# Altium project keyboard_full.PrjPcb
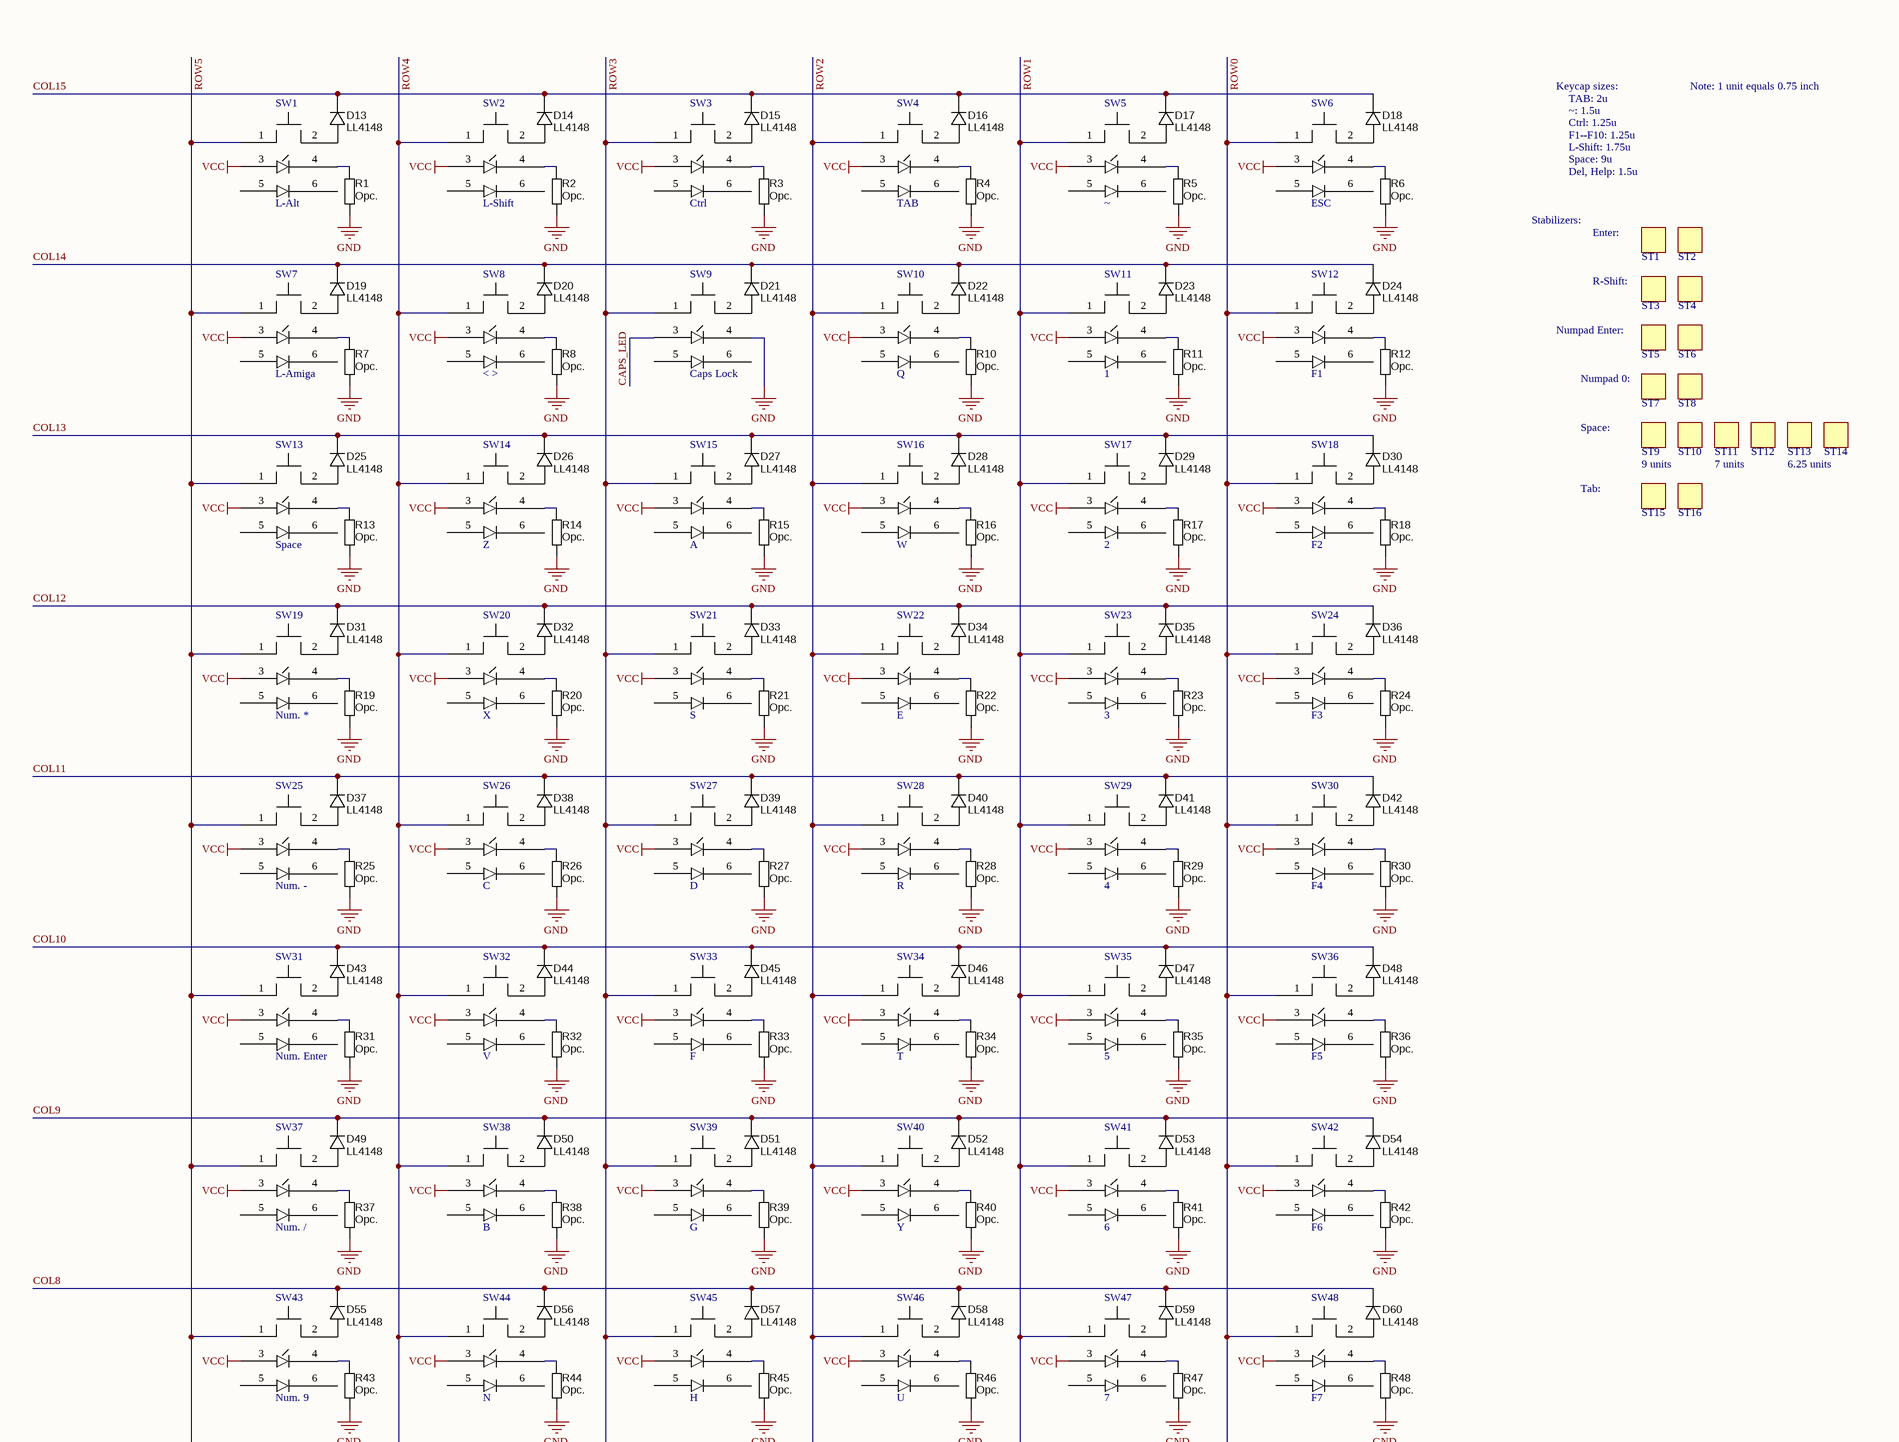
[diagram p0: keyboard_matrix_full.SchDoc, top]
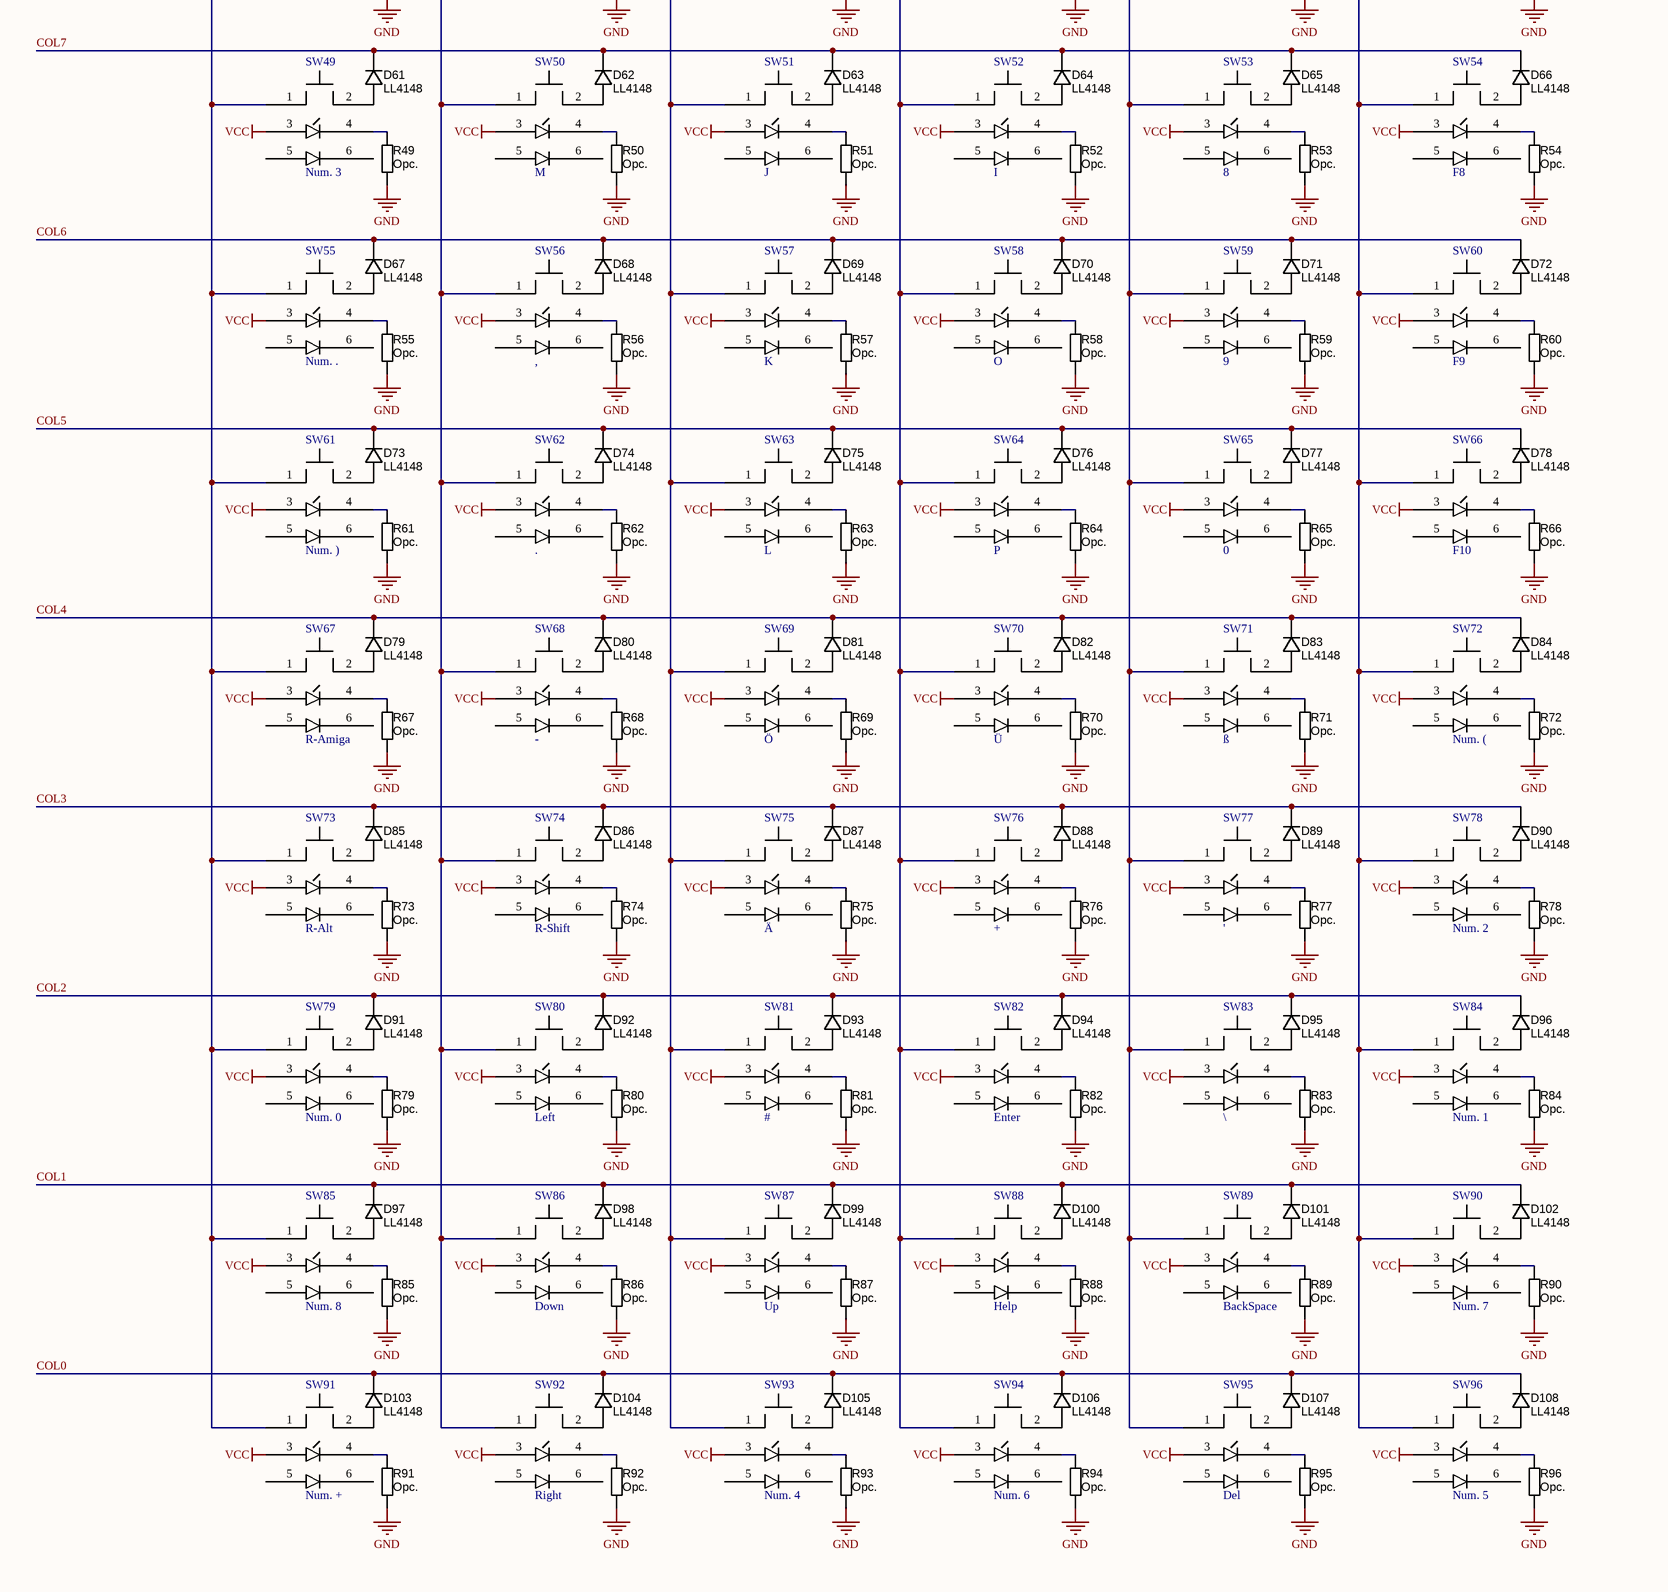
[diagram p1: keyboard_matrix_full.SchDoc, bottom]
2 sheets, 342 parts. Net scope: global (net labels, ports and power ports of the same name join across sheets).
Board file: keyboard_full.PcbDoc
Sheets:
  keyboard_matrix_full.SchDoc
  keyboard_controller.SchDoc

## Sheet keyboard_matrix_full.SchDoc
size 419 x 594 mm

### Parts
D13  Manufacturer Part Number 1: LL4148  [SOD80, LL-34]  (hidden comment: Mini MELF)
D14  Manufacturer Part Number 1: LL4148  [SOD80, LL-34]  (hidden comment: Mini MELF)
D15  Manufacturer Part Number 1: LL4148  [SOD80, LL-34]  (hidden comment: Mini MELF)
D16  Manufacturer Part Number 1: LL4148  [SOD80, LL-34]  (hidden comment: Mini MELF)
D17  Manufacturer Part Number 1: LL4148  [SOD80, LL-34]  (hidden comment: Mini MELF)
D18  Manufacturer Part Number 1: LL4148  [SOD80, LL-34]  (hidden comment: Mini MELF)
D19  Manufacturer Part Number 1: LL4148  [SOD80, LL-34]  (hidden comment: Mini MELF)
D20  Manufacturer Part Number 1: LL4148  [SOD80, LL-34]  (hidden comment: Mini MELF)
D21  Manufacturer Part Number 1: LL4148  [SOD80, LL-34]  (hidden comment: Mini MELF)
D22  Manufacturer Part Number 1: LL4148  [SOD80, LL-34]  (hidden comment: Mini MELF)
D23  Manufacturer Part Number 1: LL4148  [SOD80, LL-34]  (hidden comment: Mini MELF)
D24  Manufacturer Part Number 1: LL4148  [SOD80, LL-34]  (hidden comment: Mini MELF)
D25  Manufacturer Part Number 1: LL4148  [SOD80, LL-34]  (hidden comment: Mini MELF)
D26  Manufacturer Part Number 1: LL4148  [SOD80, LL-34]  (hidden comment: Mini MELF)
D27  Manufacturer Part Number 1: LL4148  [SOD80, LL-34]  (hidden comment: Mini MELF)
D28  Manufacturer Part Number 1: LL4148  [SOD80, LL-34]  (hidden comment: Mini MELF)
D29  Manufacturer Part Number 1: LL4148  [SOD80, LL-34]  (hidden comment: Mini MELF)
D30  Manufacturer Part Number 1: LL4148  [SOD80, LL-34]  (hidden comment: Mini MELF)
D31  Manufacturer Part Number 1: LL4148  [SOD80, LL-34]  (hidden comment: Mini MELF)
D32  Manufacturer Part Number 1: LL4148  [SOD80, LL-34]  (hidden comment: Mini MELF)
D33  Manufacturer Part Number 1: LL4148  [SOD80, LL-34]  (hidden comment: Mini MELF)
D34  Manufacturer Part Number 1: LL4148  [SOD80, LL-34]  (hidden comment: Mini MELF)
D35  Manufacturer Part Number 1: LL4148  [SOD80, LL-34]  (hidden comment: Mini MELF)
D36  Manufacturer Part Number 1: LL4148  [SOD80, LL-34]  (hidden comment: Mini MELF)
D37  Manufacturer Part Number 1: LL4148  [SOD80, LL-34]  (hidden comment: Mini MELF)
D38  Manufacturer Part Number 1: LL4148  [SOD80, LL-34]  (hidden comment: Mini MELF)
D39  Manufacturer Part Number 1: LL4148  [SOD80, LL-34]  (hidden comment: Mini MELF)
D40  Manufacturer Part Number 1: LL4148  [SOD80, LL-34]  (hidden comment: Mini MELF)
D41  Manufacturer Part Number 1: LL4148  [SOD80, LL-34]  (hidden comment: Mini MELF)
D42  Manufacturer Part Number 1: LL4148  [SOD80, LL-34]  (hidden comment: Mini MELF)
D43  Manufacturer Part Number 1: LL4148  [SOD80, LL-34]  (hidden comment: Mini MELF)
D44  Manufacturer Part Number 1: LL4148  [SOD80, LL-34]  (hidden comment: Mini MELF)
D45  Manufacturer Part Number 1: LL4148  [SOD80, LL-34]  (hidden comment: Mini MELF)
D46  Manufacturer Part Number 1: LL4148  [SOD80, LL-34]  (hidden comment: Mini MELF)
D47  Manufacturer Part Number 1: LL4148  [SOD80, LL-34]  (hidden comment: Mini MELF)
D48  Manufacturer Part Number 1: LL4148  [SOD80, LL-34]  (hidden comment: Mini MELF)
D49  Manufacturer Part Number 1: LL4148  [SOD80, LL-34]  (hidden comment: Mini MELF)
D50  Manufacturer Part Number 1: LL4148  [SOD80, LL-34]  (hidden comment: Mini MELF)
D51  Manufacturer Part Number 1: LL4148  [SOD80, LL-34]  (hidden comment: Mini MELF)
D52  Manufacturer Part Number 1: LL4148  [SOD80, LL-34]  (hidden comment: Mini MELF)
D53  Manufacturer Part Number 1: LL4148  [SOD80, LL-34]  (hidden comment: Mini MELF)
D54  Manufacturer Part Number 1: LL4148  [SOD80, LL-34]  (hidden comment: Mini MELF)
D55  Manufacturer Part Number 1: LL4148  [SOD80, LL-34]  (hidden comment: Mini MELF)
D56  Manufacturer Part Number 1: LL4148  [SOD80, LL-34]  (hidden comment: Mini MELF)
D57  Manufacturer Part Number 1: LL4148  [SOD80, LL-34]  (hidden comment: Mini MELF)
D58  Manufacturer Part Number 1: LL4148  [SOD80, LL-34]  (hidden comment: Mini MELF)
D59  Manufacturer Part Number 1: LL4148  [SOD80, LL-34]  (hidden comment: Mini MELF)
D60  Manufacturer Part Number 1: LL4148  [SOD80, LL-34]  (hidden comment: Mini MELF)
D61  Manufacturer Part Number 1: LL4148  [SOD80, LL-34]  (hidden comment: Mini MELF)
D62  Manufacturer Part Number 1: LL4148  [SOD80, LL-34]  (hidden comment: Mini MELF)
D63  Manufacturer Part Number 1: LL4148  [SOD80, LL-34]  (hidden comment: Mini MELF)
D64  Manufacturer Part Number 1: LL4148  [SOD80, LL-34]  (hidden comment: Mini MELF)
D65  Manufacturer Part Number 1: LL4148  [SOD80, LL-34]  (hidden comment: Mini MELF)
D66  Manufacturer Part Number 1: LL4148  [SOD80, LL-34]  (hidden comment: Mini MELF)
D67  Manufacturer Part Number 1: LL4148  [SOD80, LL-34]  (hidden comment: Mini MELF)
D68  Manufacturer Part Number 1: LL4148  [SOD80, LL-34]  (hidden comment: Mini MELF)
D69  Manufacturer Part Number 1: LL4148  [SOD80, LL-34]  (hidden comment: Mini MELF)
D70  Manufacturer Part Number 1: LL4148  [SOD80, LL-34]  (hidden comment: Mini MELF)
D71  Manufacturer Part Number 1: LL4148  [SOD80, LL-34]  (hidden comment: Mini MELF)
D72  Manufacturer Part Number 1: LL4148  [SOD80, LL-34]  (hidden comment: Mini MELF)
D73  Manufacturer Part Number 1: LL4148  [SOD80, LL-34]  (hidden comment: Mini MELF)
D74  Manufacturer Part Number 1: LL4148  [SOD80, LL-34]  (hidden comment: Mini MELF)
D75  Manufacturer Part Number 1: LL4148  [SOD80, LL-34]  (hidden comment: Mini MELF)
D76  Manufacturer Part Number 1: LL4148  [SOD80, LL-34]  (hidden comment: Mini MELF)
D77  Manufacturer Part Number 1: LL4148  [SOD80, LL-34]  (hidden comment: Mini MELF)
D78  Manufacturer Part Number 1: LL4148  [SOD80, LL-34]  (hidden comment: Mini MELF)
D79  Manufacturer Part Number 1: LL4148  [SOD80, LL-34]  (hidden comment: Mini MELF)
D80  Manufacturer Part Number 1: LL4148  [SOD80, LL-34]  (hidden comment: Mini MELF)
D81  Manufacturer Part Number 1: LL4148  [SOD80, LL-34]  (hidden comment: Mini MELF)
D82  Manufacturer Part Number 1: LL4148  [SOD80, LL-34]  (hidden comment: Mini MELF)
D83  Manufacturer Part Number 1: LL4148  [SOD80, LL-34]  (hidden comment: Mini MELF)
D84  Manufacturer Part Number 1: LL4148  [SOD80, LL-34]  (hidden comment: Mini MELF)
D85  Manufacturer Part Number 1: LL4148  [SOD80, LL-34]  (hidden comment: Mini MELF)
D86  Manufacturer Part Number 1: LL4148  [SOD80, LL-34]  (hidden comment: Mini MELF)
D87  Manufacturer Part Number 1: LL4148  [SOD80, LL-34]  (hidden comment: Mini MELF)
D88  Manufacturer Part Number 1: LL4148  [SOD80, LL-34]  (hidden comment: Mini MELF)
D89  Manufacturer Part Number 1: LL4148  [SOD80, LL-34]  (hidden comment: Mini MELF)
D90  Manufacturer Part Number 1: LL4148  [SOD80, LL-34]  (hidden comment: Mini MELF)
D91  Manufacturer Part Number 1: LL4148  [SOD80, LL-34]  (hidden comment: Mini MELF)
D92  Manufacturer Part Number 1: LL4148  [SOD80, LL-34]  (hidden comment: Mini MELF)
D93  Manufacturer Part Number 1: LL4148  [SOD80, LL-34]  (hidden comment: Mini MELF)
D94  Manufacturer Part Number 1: LL4148  [SOD80, LL-34]  (hidden comment: Mini MELF)
D95  Manufacturer Part Number 1: LL4148  [SOD80, LL-34]  (hidden comment: Mini MELF)
D96  Manufacturer Part Number 1: LL4148  [SOD80, LL-34]  (hidden comment: Mini MELF)
D97  Manufacturer Part Number 1: LL4148  [SOD80, LL-34]  (hidden comment: Mini MELF)
D98  Manufacturer Part Number 1: LL4148  [SOD80, LL-34]  (hidden comment: Mini MELF)
D99  Manufacturer Part Number 1: LL4148  [SOD80, LL-34]  (hidden comment: Mini MELF)
D100  Manufacturer Part Number 1: LL4148  [SOD80, LL-34]  (hidden comment: Mini MELF)
D101  Manufacturer Part Number 1: LL4148  [SOD80, LL-34]  (hidden comment: Mini MELF)
D102  Manufacturer Part Number 1: LL4148  [SOD80, LL-34]  (hidden comment: Mini MELF)
D103  Manufacturer Part Number 1: LL4148  [SOD80, LL-34]  (hidden comment: Mini MELF)
D104  Manufacturer Part Number 1: LL4148  [SOD80, LL-34]  (hidden comment: Mini MELF)
D105  Manufacturer Part Number 1: LL4148  [SOD80, LL-34]  (hidden comment: Mini MELF)
D106  Manufacturer Part Number 1: LL4148  [SOD80, LL-34]  (hidden comment: Mini MELF)
D107  Manufacturer Part Number 1: LL4148  [SOD80, LL-34]  (hidden comment: Mini MELF)
D108  Manufacturer Part Number 1: LL4148  [SOD80, LL-34]  (hidden comment: Mini MELF)
R1  value Opc.  [RESC2012N_ZERO]  (hidden comment: 0805)
R2  value Opc.  [RESC2012N_ZERO]  (hidden comment: 0805)
R3  value Opc.  [RESC2012N_ZERO]  (hidden comment: 0805)
R4  value Opc.  [RESC2012N_ZERO]  (hidden comment: 0805)
R5  value Opc.  [RESC2012N_ZERO]  (hidden comment: 0805)
R6  value Opc.  [RESC2012N_ZERO]  (hidden comment: 0805)
R7  value Opc.  [RESC2012N_ZERO]  (hidden comment: 0805)
R8  value Opc.  [RESC2012N_ZERO]  (hidden comment: 0805)
R10  value Opc.  [RESC2012N_ZERO]  (hidden comment: 0805)
R11  value Opc.  [RESC2012N_ZERO]  (hidden comment: 0805)
R12  value Opc.  [RESC2012N_ZERO]  (hidden comment: 0805)
R13  value Opc.  [RESC2012N_ZERO]  (hidden comment: 0805)
R14  value Opc.  [RESC2012N_ZERO]  (hidden comment: 0805)
R15  value Opc.  [RESC2012N_ZERO]  (hidden comment: 0805)
R16  value Opc.  [RESC2012N_ZERO]  (hidden comment: 0805)
R17  value Opc.  [RESC2012N_ZERO]  (hidden comment: 0805)
R18  value Opc.  [RESC2012N_ZERO]  (hidden comment: 0805)
R19  value Opc.  [RESC2012N_ZERO]  (hidden comment: 0805)
R20  value Opc.  [RESC2012N_ZERO]  (hidden comment: 0805)
R21  value Opc.  [RESC2012N_ZERO]  (hidden comment: 0805)
R22  value Opc.  [RESC2012N_ZERO]  (hidden comment: 0805)
R23  value Opc.  [RESC2012N_ZERO]  (hidden comment: 0805)
R24  value Opc.  [RESC2012N_ZERO]  (hidden comment: 0805)
R25  value Opc.  [RESC2012N_ZERO]  (hidden comment: 0805)
R26  value Opc.  [RESC2012N_ZERO]  (hidden comment: 0805)
R27  value Opc.  [RESC2012N_ZERO]  (hidden comment: 0805)
R28  value Opc.  [RESC2012N_ZERO]  (hidden comment: 0805)
R29  value Opc.  [RESC2012N_ZERO]  (hidden comment: 0805)
R30  value Opc.  [RESC2012N_ZERO]  (hidden comment: 0805)
R31  value Opc.  [RESC2012N_ZERO]  (hidden comment: 0805)
R32  value Opc.  [RESC2012N_ZERO]  (hidden comment: 0805)
R33  value Opc.  [RESC2012N_ZERO]  (hidden comment: 0805)
R34  value Opc.  [RESC2012N_ZERO]  (hidden comment: 0805)
R35  value Opc.  [RESC2012N_ZERO]  (hidden comment: 0805)
R36  value Opc.  [RESC2012N_ZERO]  (hidden comment: 0805)
R37  value Opc.  [RESC2012N_ZERO]  (hidden comment: 0805)
R38  value Opc.  [RESC2012N_ZERO]  (hidden comment: 0805)
R39  value Opc.  [RESC2012N_ZERO]  (hidden comment: 0805)
R40  value Opc.  [RESC2012N_ZERO]  (hidden comment: 0805)
R41  value Opc.  [RESC2012N_ZERO]  (hidden comment: 0805)
R42  value Opc.  [RESC2012N_ZERO]  (hidden comment: 0805)
R43  value Opc.  [RESC2012N_ZERO]  (hidden comment: 0805)
R44  value Opc.  [RESC2012N_ZERO]  (hidden comment: 0805)
R45  value Opc.  [RESC2012N_ZERO]  (hidden comment: 0805)
R46  value Opc.  [RESC2012N_ZERO]  (hidden comment: 0805)
R47  value Opc.  [RESC2012N_ZERO]  (hidden comment: 0805)
R48  value Opc.  [RESC2012N_ZERO]  (hidden comment: 0805)
R49  value Opc.  [RESC2012N_ZERO]  (hidden comment: 0805)
R50  value Opc.  [RESC2012N_ZERO]  (hidden comment: 0805)
R51  value Opc.  [RESC2012N_ZERO]  (hidden comment: 0805)
R52  value Opc.  [RESC2012N_ZERO]  (hidden comment: 0805)
R53  value Opc.  [RESC2012N_ZERO]  (hidden comment: 0805)
R54  value Opc.  [RESC2012N_ZERO]  (hidden comment: 0805)
R55  value Opc.  [RESC2012N_ZERO]  (hidden comment: 0805)
R56  value Opc.  [RESC2012N_ZERO]  (hidden comment: 0805)
R57  value Opc.  [RESC2012N_ZERO]  (hidden comment: 0805)
R58  value Opc.  [RESC2012N_ZERO]  (hidden comment: 0805)
R59  value Opc.  [RESC2012N_ZERO]  (hidden comment: 0805)
R60  value Opc.  [RESC2012N_ZERO]  (hidden comment: 0805)
R61  value Opc.  [RESC2012N_ZERO]  (hidden comment: 0805)
R62  value Opc.  [RESC2012N_ZERO]  (hidden comment: 0805)
R63  value Opc.  [RESC2012N_ZERO]  (hidden comment: 0805)
R64  value Opc.  [RESC2012N_ZERO]  (hidden comment: 0805)
R65  value Opc.  [RESC2012N_ZERO]  (hidden comment: 0805)
R66  value Opc.  [RESC2012N_ZERO]  (hidden comment: 0805)
R67  value Opc.  [RESC2012N_ZERO]  (hidden comment: 0805)
R68  value Opc.  [RESC2012N_ZERO]  (hidden comment: 0805)
R69  value Opc.  [RESC2012N_ZERO]  (hidden comment: 0805)
R70  value Opc.  [RESC2012N_ZERO]  (hidden comment: 0805)
R71  value Opc.  [RESC2012N_ZERO]  (hidden comment: 0805)
R72  value Opc.  [RESC2012N_ZERO]  (hidden comment: 0805)
R73  value Opc.  [RESC2012N_ZERO]  (hidden comment: 0805)
R74  value Opc.  [RESC2012N_ZERO]  (hidden comment: 0805)
R75  value Opc.  [RESC2012N_ZERO]  (hidden comment: 0805)
R76  value Opc.  [RESC2012N_ZERO]  (hidden comment: 0805)
R77  value Opc.  [RESC2012N_ZERO]  (hidden comment: 0805)
R78  value Opc.  [RESC2012N_ZERO]  (hidden comment: 0805)
R79  value Opc.  [RESC2012N_ZERO]  (hidden comment: 0805)
R80  value Opc.  [RESC2012N_ZERO]  (hidden comment: 0805)
R81  value Opc.  [RESC2012N_ZERO]  (hidden comment: 0805)
R82  value Opc.  [RESC2012N_ZERO]  (hidden comment: 0805)
R83  value Opc.  [RESC2012N_ZERO]  (hidden comment: 0805)
R84  value Opc.  [RESC2012N_ZERO]  (hidden comment: 0805)
R85  value Opc.  [RESC2012N_ZERO]  (hidden comment: 0805)
R86  value Opc.  [RESC2012N_ZERO]  (hidden comment: 0805)
R87  value Opc.  [RESC2012N_ZERO]  (hidden comment: 0805)
R88  value Opc.  [RESC2012N_ZERO]  (hidden comment: 0805)
R89  value Opc.  [RESC2012N_ZERO]  (hidden comment: 0805)
R90  value Opc.  [RESC2012N_ZERO]  (hidden comment: 0805)
R91  value Opc.  [RESC2012N_ZERO]  (hidden comment: 0805)
R92  value Opc.  [RESC2012N_ZERO]  (hidden comment: 0805)
R93  value Opc.  [RESC2012N_ZERO]  (hidden comment: 0805)
R94  value Opc.  [RESC2012N_ZERO]  (hidden comment: 0805)
R95  value Opc.  [RESC2012N_ZERO]  (hidden comment: 0805)
R96  value Opc.  [RESC2012N_ZERO]  (hidden comment: 0805)
ST1  Cherry MX Stabilizer  [CHERRYMX_STAB]  (value not drawn)
ST2  Cherry MX Stabilizer  [CHERRYMX_STAB]  (value not drawn)
ST3  Cherry MX Stabilizer  [CHERRYMX_STAB]  (value not drawn)
ST4  Cherry MX Stabilizer  [CHERRYMX_STAB]  (value not drawn)
ST5  Cherry MX Stabilizer  [CHERRYMX_STAB]  (value not drawn)
ST6  Cherry MX Stabilizer  [CHERRYMX_STAB]  (value not drawn)
ST7  Cherry MX Stabilizer  [CHERRYMX_STAB]  (value not drawn)
ST8  Cherry MX Stabilizer  [CHERRYMX_STAB]  (value not drawn)
ST9  Cherry MX Stabilizer  [CHERRYMX_STAB]  (value not drawn)
ST10  Cherry MX Stabilizer  [CHERRYMX_STAB]  (value not drawn)
ST11  Cherry MX Stabilizer  [CHERRYMX_STAB]  (value not drawn)
ST12  Cherry MX Stabilizer  [CHERRYMX_STAB]  (value not drawn)
ST13  Cherry MX Stabilizer  [CHERRYMX_STAB]  (value not drawn)
ST14  Cherry MX Stabilizer  [CHERRYMX_STAB]  (value not drawn)
ST15  Cherry MX Stabilizer  [CHERRYMX_STAB]  (value not drawn)
ST16  Cherry MX Stabilizer  [CHERRYMX_STAB]  (value not drawn)
SW1  L-Alt  [CHERRYMX_5PIN]
SW2  L-Shift  [CHERRYMX_5PIN]
SW3  Ctrl  [CHERRYMX_5PIN]
SW4  TAB  [CHERRYMX_5PIN]
SW5  ~  [CHERRYMX_5PIN]
SW6  ESC  [CHERRYMX_5PIN]
SW7  L-Amiga  [CHERRYMX_5PIN]
SW8  < >  [CHERRYMX_5PIN]
SW9  Caps Lock  [CHERRYMX_5PIN]
SW10  Q  [CHERRYMX_5PIN]
SW11  1  [CHERRYMX_5PIN]
SW12  F1  [CHERRYMX_5PIN]
SW13  Space  [CHERRYMX_5PIN]
SW14  Z  [CHERRYMX_5PIN]
SW15  A  [CHERRYMX_5PIN]
SW16  W  [CHERRYMX_5PIN]
SW17  2  [CHERRYMX_5PIN]
SW18  F2  [CHERRYMX_5PIN]
SW19  Num. *  [CHERRYMX_5PIN]
SW20  X  [CHERRYMX_5PIN]
SW21  S  [CHERRYMX_5PIN]
SW22  E  [CHERRYMX_5PIN]
SW23  3  [CHERRYMX_5PIN]
SW24  F3  [CHERRYMX_5PIN]
SW25  Num. -  [CHERRYMX_5PIN]
SW26  C  [CHERRYMX_5PIN]
SW27  D  [CHERRYMX_5PIN]
SW28  R  [CHERRYMX_5PIN]
SW29  4  [CHERRYMX_5PIN]
SW30  F4  [CHERRYMX_5PIN]
SW31  Num. Enter  [CHERRYMX_5PIN]
SW32  V  [CHERRYMX_5PIN]
SW33  F  [CHERRYMX_5PIN]
SW34  T  [CHERRYMX_5PIN]
SW35  5  [CHERRYMX_5PIN]
SW36  F5  [CHERRYMX_5PIN]
SW37  Num. /  [CHERRYMX_5PIN]
SW38  B  [CHERRYMX_5PIN]
SW39  G  [CHERRYMX_5PIN]
SW40  Y  [CHERRYMX_5PIN]
SW41  6  [CHERRYMX_5PIN]
SW42  F6  [CHERRYMX_5PIN]
SW43  Num. 9  [CHERRYMX_5PIN]
SW44  N  [CHERRYMX_5PIN]
SW45  H  [CHERRYMX_5PIN]
SW46  U  [CHERRYMX_5PIN]
SW47  7  [CHERRYMX_5PIN]
SW48  F7  [CHERRYMX_5PIN]
SW49  Num. 3  [CHERRYMX_5PIN]
SW50  M  [CHERRYMX_5PIN]
SW51  J  [CHERRYMX_5PIN]
SW52  I  [CHERRYMX_5PIN]
SW53  8  [CHERRYMX_5PIN]
SW54  F8  [CHERRYMX_5PIN]
SW55  Num. .  [CHERRYMX_5PIN]
SW56  ,  [CHERRYMX_5PIN]
SW57  K  [CHERRYMX_5PIN]
SW58  O  [CHERRYMX_5PIN]
SW59  9  [CHERRYMX_5PIN]
SW60  F9  [CHERRYMX_5PIN]
SW61  Num. )  [CHERRYMX_5PIN]
SW62  .  [CHERRYMX_5PIN]
SW63  L  [CHERRYMX_5PIN]
SW64  P  [CHERRYMX_5PIN]
SW65  0  [CHERRYMX_5PIN]
SW66  F10  [CHERRYMX_5PIN]
SW67  R-Amiga  [CHERRYMX_5PIN]
SW68  -  [CHERRYMX_5PIN]
SW69  Ö  [CHERRYMX_5PIN]
SW70  Ü  [CHERRYMX_5PIN]
SW71  ß  [CHERRYMX_5PIN]
SW72  Num. (  [CHERRYMX_5PIN]
SW73  R-Alt  [CHERRYMX_5PIN]
SW74  R-Shift  [CHERRYMX_5PIN]
SW75  Ä  [CHERRYMX_5PIN]
SW76  +  [CHERRYMX_5PIN]
SW77  '  [CHERRYMX_5PIN]
SW78  Num. 2  [CHERRYMX_5PIN]
SW79  Num. 0  [CHERRYMX_5PIN]
SW80  Left  [CHERRYMX_5PIN]
SW81  #  [CHERRYMX_5PIN]
SW82  Enter  [CHERRYMX_5PIN]
SW83  \  [CHERRYMX_5PIN]
SW84  Num. 1  [CHERRYMX_5PIN]
SW85  Num. 8  [CHERRYMX_5PIN]
SW86  Down  [CHERRYMX_5PIN]
SW87  Up  [CHERRYMX_5PIN]
SW88  Help  [CHERRYMX_5PIN]
SW89  BackSpace  [CHERRYMX_5PIN]
SW90  Num. 7  [CHERRYMX_5PIN]
SW91  Num. +  [CHERRYMX_5PIN]
SW92  Right  [CHERRYMX_5PIN]
SW93  Num. 4  [CHERRYMX_5PIN]
SW94  Num. 6  [CHERRYMX_5PIN]
SW95  Del  [CHERRYMX_5PIN]
SW96  Num. 5  [CHERRYMX_5PIN]

### Nets
GND: R1.2 R2.2 R3.2 R4.2 R5.2 R6.2 R7.2 R8.2 R10.2 R11.2 R12.2 R13.2 R14.2 R15.2 R16.2 R17.2 R18.2 R19.2 R20.2 R21.2 R22.2 R23.2 R24.2 R25.2 R26.2 R27.2 R28.2 R29.2 R30.2 R31.2 R32.2 R33.2 R34.2 R35.2 R36.2 R37.2 R38.2 R39.2 R40.2 R41.2 R42.2 R43.2 R44.2 R45.2 R46.2 R47.2 R48.2 R49.2 R50.2 R51.2 R52.2 R53.2 R54.2 R55.2 R56.2 R57.2 R58.2 R59.2 R60.2 R61.2 R62.2 R63.2 R64.2 R65.2 R66.2 R67.2 R68.2 R69.2 R70.2 R71.2 R72.2 R73.2 R74.2 R75.2 R76.2 R77.2 R78.2 R79.2 R80.2 R81.2 R82.2 R83.2 R84.2 R85.2 R86.2 R87.2 R88.2 R89.2 R90.2 R91.2 R92.2 R93.2 R94.2 R95.2 R96.2 SW9.4
VCC: SW1.3 SW2.3 SW3.3 SW4.3 SW5.3 SW6.3 SW7.3 SW8.3 SW10.3 SW11.3 SW12.3 SW13.3 SW14.3 SW15.3 SW16.3 SW17.3 SW18.3 SW19.3 SW20.3 SW21.3 SW22.3 SW23.3 SW24.3 SW25.3 SW26.3 SW27.3 SW28.3 SW29.3 SW30.3 SW31.3 SW32.3 SW33.3 SW34.3 SW35.3 SW36.3 SW37.3 SW38.3 SW39.3 SW40.3 SW41.3 SW42.3 SW43.3 SW44.3 SW45.3 SW46.3 SW47.3 SW48.3 SW49.3 SW50.3 SW51.3 SW52.3 SW53.3 SW54.3 SW55.3 SW56.3 SW57.3 SW58.3 SW59.3 SW60.3 SW61.3 SW62.3 SW63.3 SW64.3 SW65.3 SW66.3 SW67.3 SW68.3 SW69.3 SW70.3 SW71.3 SW72.3 SW73.3 SW74.3 SW75.3 SW76.3 SW77.3 SW78.3 SW79.3 SW80.3 SW81.3 SW82.3 SW83.3 SW84.3 SW85.3 SW86.3 SW87.3 SW88.3 SW89.3 SW90.3 SW91.3 SW92.3 SW93.3 SW94.3 SW95.3 SW96.3
CAPS_LED: SW9.3
COL0: D103.K D104.K D105.K D106.K D107.K D108.K
COL1: D97.K D98.K D99.K D100.K D101.K D102.K
COL2: D91.K D92.K D93.K D94.K D95.K D96.K
COL3: D85.K D86.K D87.K D88.K D89.K D90.K
COL4: D79.K D80.K D81.K D82.K D83.K D84.K
COL5: D73.K D74.K D75.K D76.K D77.K D78.K
COL6: D67.K D68.K D69.K D70.K D71.K D72.K
COL7: D61.K D62.K D63.K D64.K D65.K D66.K
COL8: D55.K D56.K D57.K D58.K D59.K D60.K
COL9: D49.K D50.K D51.K D52.K D53.K D54.K
COL10: D43.K D44.K D45.K D46.K D47.K D48.K
COL11: D37.K D38.K D39.K D40.K D41.K D42.K
COL12: D31.K D32.K D33.K D34.K D35.K D36.K
COL13: D25.K D26.K D27.K D28.K D29.K D30.K
COL14: D19.K D20.K D21.K D22.K D23.K D24.K
COL15: D13.K D14.K D15.K D16.K D17.K D18.K
ROW0: SW6.1 SW12.1 SW18.1 SW24.1 SW30.1 SW36.1 SW42.1 SW48.1 SW54.1 SW60.1 SW66.1 SW72.1 SW78.1 SW84.1 SW90.1 SW96.1
ROW1: SW5.1 SW11.1 SW17.1 SW23.1 SW29.1 SW35.1 SW41.1 SW47.1 SW53.1 SW59.1 SW65.1 SW71.1 SW77.1 SW83.1 SW89.1 SW95.1
ROW2: SW4.1 SW10.1 SW16.1 SW22.1 SW28.1 SW34.1 SW40.1 SW46.1 SW52.1 SW58.1 SW64.1 SW70.1 SW76.1 SW82.1 SW88.1 SW94.1
ROW3: SW3.1 SW9.1 SW15.1 SW21.1 SW27.1 SW33.1 SW39.1 SW45.1 SW51.1 SW57.1 SW63.1 SW69.1 SW75.1 SW81.1 SW87.1 SW93.1
ROW4: SW2.1 SW8.1 SW14.1 SW20.1 SW26.1 SW32.1 SW38.1 SW44.1 SW50.1 SW56.1 SW62.1 SW68.1 SW74.1 SW80.1 SW86.1 SW92.1
ROW5: SW1.1 SW7.1 SW13.1 SW19.1 SW25.1 SW31.1 SW37.1 SW43.1 SW49.1 SW55.1 SW61.1 SW67.1 SW73.1 SW79.1 SW85.1 SW91.1
NetD13_A: D13.A SW1.2
NetD14_A: D14.A SW2.2
NetD15_A: D15.A SW3.2
NetD16_A: D16.A SW4.2
NetD17_A: D17.A SW5.2
NetD18_A: D18.A SW6.2
NetD19_A: D19.A SW7.2
NetD20_A: D20.A SW8.2
NetD21_A: D21.A SW9.2
NetD22_A: D22.A SW10.2
NetD23_A: D23.A SW11.2
NetD24_A: D24.A SW12.2
NetD25_A: D25.A SW13.2
NetD26_A: D26.A SW14.2
NetD27_A: D27.A SW15.2
NetD28_A: D28.A SW16.2
NetD29_A: D29.A SW17.2
NetD30_A: D30.A SW18.2
NetD31_A: D31.A SW19.2
NetD32_A: D32.A SW20.2
NetD33_A: D33.A SW21.2
NetD34_A: D34.A SW22.2
NetD35_A: D35.A SW23.2
NetD36_A: D36.A SW24.2
NetD37_A: D37.A SW25.2
NetD38_A: D38.A SW26.2
NetD39_A: D39.A SW27.2
NetD40_A: D40.A SW28.2
NetD41_A: D41.A SW29.2
NetD42_A: D42.A SW30.2
NetD43_A: D43.A SW31.2
NetD44_A: D44.A SW32.2
NetD45_A: D45.A SW33.2
NetD46_A: D46.A SW34.2
NetD47_A: D47.A SW35.2
NetD48_A: D48.A SW36.2
NetD49_A: D49.A SW37.2
NetD50_A: D50.A SW38.2
NetD51_A: D51.A SW39.2
NetD52_A: D52.A SW40.2
NetD53_A: D53.A SW41.2
NetD54_A: D54.A SW42.2
NetD55_A: D55.A SW43.2
NetD56_A: D56.A SW44.2
NetD57_A: D57.A SW45.2
NetD58_A: D58.A SW46.2
NetD59_A: D59.A SW47.2
NetD60_A: D60.A SW48.2
NetD61_A: D61.A SW49.2
NetD62_A: D62.A SW50.2
NetD63_A: D63.A SW51.2
NetD64_A: D64.A SW52.2
NetD65_A: D65.A SW53.2
NetD66_A: D66.A SW54.2
NetD67_A: D67.A SW55.2
NetD68_A: D68.A SW56.2
NetD69_A: D69.A SW57.2
NetD70_A: D70.A SW58.2
NetD71_A: D71.A SW59.2
NetD72_A: D72.A SW60.2
NetD73_A: D73.A SW61.2
NetD74_A: D74.A SW62.2
NetD75_A: D75.A SW63.2
NetD76_A: D76.A SW64.2
NetD77_A: D77.A SW65.2
NetD78_A: D78.A SW66.2
NetD79_A: D79.A SW67.2
NetD80_A: D80.A SW68.2
NetD81_A: D81.A SW69.2
NetD82_A: D82.A SW70.2
NetD83_A: D83.A SW71.2
NetD84_A: D84.A SW72.2
NetD85_A: D85.A SW73.2
NetD86_A: D86.A SW74.2
NetD87_A: D87.A SW75.2
NetD88_A: D88.A SW76.2
NetD89_A: D89.A SW77.2
NetD90_A: D90.A SW78.2
NetD91_A: D91.A SW79.2
NetD92_A: D92.A SW80.2
NetD93_A: D93.A SW81.2
NetD94_A: D94.A SW82.2
NetD95_A: D95.A SW83.2
NetD96_A: D96.A SW84.2
NetD97_A: D97.A SW85.2
NetD98_A: D98.A SW86.2
NetD99_A: D99.A SW87.2
NetD100_A: D100.A SW88.2
NetD101_A: D101.A SW89.2
NetD102_A: D102.A SW90.2
NetD103_A: D103.A SW91.2
NetD104_A: D104.A SW92.2
NetD105_A: D105.A SW93.2
NetD106_A: D106.A SW94.2
NetD107_A: D107.A SW95.2
NetD108_A: D108.A SW96.2
NetR1_1: R1.1 SW1.4
NetR2_1: R2.1 SW2.4
NetR3_1: R3.1 SW3.4
NetR4_1: R4.1 SW4.4
NetR5_1: R5.1 SW5.4
NetR6_1: R6.1 SW6.4
NetR7_1: R7.1 SW7.4
NetR8_1: R8.1 SW8.4
NetR10_1: R10.1 SW10.4
NetR11_1: R11.1 SW11.4
NetR12_1: R12.1 SW12.4
NetR13_1: R13.1 SW13.4
NetR14_1: R14.1 SW14.4
NetR15_1: R15.1 SW15.4
NetR16_1: R16.1 SW16.4
NetR17_1: R17.1 SW17.4
NetR18_1: R18.1 SW18.4
NetR19_1: R19.1 SW19.4
NetR20_1: R20.1 SW20.4
NetR21_1: R21.1 SW21.4
NetR22_1: R22.1 SW22.4
NetR23_1: R23.1 SW23.4
NetR24_1: R24.1 SW24.4
NetR25_1: R25.1 SW25.4
NetR26_1: R26.1 SW26.4
NetR27_1: R27.1 SW27.4
NetR28_1: R28.1 SW28.4
NetR29_1: R29.1 SW29.4
NetR30_1: R30.1 SW30.4
NetR31_1: R31.1 SW31.4
NetR32_1: R32.1 SW32.4
NetR33_1: R33.1 SW33.4
NetR34_1: R34.1 SW34.4
NetR35_1: R35.1 SW35.4
NetR36_1: R36.1 SW36.4
NetR37_1: R37.1 SW37.4
NetR38_1: R38.1 SW38.4
NetR39_1: R39.1 SW39.4
NetR40_1: R40.1 SW40.4
NetR41_1: R41.1 SW41.4
NetR42_1: R42.1 SW42.4
NetR43_1: R43.1 SW43.4
NetR44_1: R44.1 SW44.4
NetR45_1: R45.1 SW45.4
NetR46_1: R46.1 SW46.4
NetR47_1: R47.1 SW47.4
NetR48_1: R48.1 SW48.4
NetR49_1: R49.1 SW49.4
NetR50_1: R50.1 SW50.4
NetR51_1: R51.1 SW51.4
NetR52_1: R52.1 SW52.4
NetR53_1: R53.1 SW53.4
NetR54_1: R54.1 SW54.4
NetR55_1: R55.1 SW55.4
NetR56_1: R56.1 SW56.4
NetR57_1: R57.1 SW57.4
NetR58_1: R58.1 SW58.4
NetR59_1: R59.1 SW59.4
NetR60_1: R60.1 SW60.4
NetR61_1: R61.1 SW61.4
NetR62_1: R62.1 SW62.4
NetR63_1: R63.1 SW63.4
NetR64_1: R64.1 SW64.4
NetR65_1: R65.1 SW65.4
NetR66_1: R66.1 SW66.4
NetR67_1: R67.1 SW67.4
NetR68_1: R68.1 SW68.4
NetR69_1: R69.1 SW69.4
NetR70_1: R70.1 SW70.4
NetR71_1: R71.1 SW71.4
NetR72_1: R72.1 SW72.4
NetR73_1: R73.1 SW73.4
NetR74_1: R74.1 SW74.4
NetR75_1: R75.1 SW75.4
NetR76_1: R76.1 SW76.4
NetR77_1: R77.1 SW77.4
NetR78_1: R78.1 SW78.4
NetR79_1: R79.1 SW79.4
NetR80_1: R80.1 SW80.4
NetR81_1: R81.1 SW81.4
NetR82_1: R82.1 SW82.4
NetR83_1: R83.1 SW83.4
NetR84_1: R84.1 SW84.4
NetR85_1: R85.1 SW85.4
NetR86_1: R86.1 SW86.4
NetR87_1: R87.1 SW87.4
NetR88_1: R88.1 SW88.4
NetR89_1: R89.1 SW89.4
NetR90_1: R90.1 SW90.4
NetR91_1: R91.1 SW91.4
NetR92_1: R92.1 SW92.4
NetR93_1: R93.1 SW93.4
NetR94_1: R94.1 SW94.4
NetR95_1: R95.1 SW95.4
NetR96_1: R96.1 SW96.4

Not connected (* = marked no-connect by the designer): SW1 5 6; SW2 5 6; SW3 5 6; SW4 5 6; SW5 5 6; SW6 5 6; SW7 5 6; SW8 5 6; SW9 5 6; SW10 5 6; SW11 5 6; SW12 5 6; SW13 5 6; SW14 5 6; SW15 5 6; SW16 5 6; SW17 5 6; SW18 5 6; SW19 5 6; SW20 5 6; SW21 5 6; SW22 5 6; SW23 5 6; SW24 5 6; SW25 5 6; SW26 5 6; SW27 5 6; SW28 5 6; SW29 5 6; SW30 5 6; SW31 5 6; SW32 5 6; SW33 5 6; SW34 5 6; SW35 5 6; SW36 5 6; SW37 5 6; SW38 5 6; SW39 5 6; SW40 5 6; SW41 5 6; SW42 5 6; SW43 5 6; SW44 5 6; SW45 5 6; SW46 5 6; SW47 5 6; SW48 5 6; SW49 5 6; SW50 5 6; SW51 5 6; SW52 5 6; SW53 5 6; SW54 5 6; SW55 5 6; SW56 5 6; SW57 5 6; SW58 5 6; SW59 5 6; SW60 5 6; SW61 5 6; SW62 5 6; SW63 5 6; SW64 5 6; SW65 5 6; SW66 5 6; SW67 5 6; SW68 5 6; SW69 5 6; SW70 5 6; SW71 5 6; SW72 5 6; SW73 5 6; SW74 5 6; SW75 5 6; SW76 5 6; SW77 5 6; SW78 5 6; SW79 5 6; SW80 5 6; SW81 5 6; SW82 5 6; SW83 5 6; SW84 5 6; SW85 5 6; SW86 5 6; SW87 5 6; SW88 5 6; SW89 5 6; SW90 5 6; SW91 5 6; SW92 5 6; SW93 5 6; SW94 5 6; SW95 5 6; SW96 5 6

### Notes on the sheet
- Keycap sizes:
- TAB: 2u
- ~: 1.5u
- Ctrl: 1.25u
- F1--F10: 1.25u
- Note: 1 unit equals 0.75 inch
- L-Shift: 1.75u
- Space: 9u
- Del, Help: 1.5u
- Stabilizers:
- (near ST1) Enter:
- (near ST3) R-Shift:
- (near ST5) Numpad Enter:
- (near ST7) Numpad 0:
- Space:
- Tab:
- 9 units
- 7 units
- 6.25 units

### Library data of the parts
D13-D108 = DIODE_100V_500mW_MELF: Diode SMD 100V 150mA 500mW SOD80; Manufacturer 1: Fairchild Semiconductor; Ratings: 100V; 150mA min; 500mW; Material: Si; Diode Type: Standard; Value: Vf=1V @ 10mA; SCDType: source; Package / Case: SOD80, LL-34; Manufacturer 2: DC Components; Manufacturer Part Number 2: DL4148; Supplier 1: Digi-Key; Supplier Part Number 1: LL4148FSCT-ND
R1-R8 R10-R96 = RES_0R_0805: Resistor SMD chip 0.0 Ohm 0.125W 0805; Manufacturer 1: Samsung Electro-Mechanics America, Inc; Manufacturer Part Number 1: RC2012J000CS; Ratings: 1/8W; SCDType: spec; Tolerance: N/A; Package / Case: 0805 (2012 metric); Supplier 1: Digi-Key; Supplier Part Number 1: 1276-5466-6-ND; RoHS 1: RoHS Compliant; ComponentLink1URL: http://www.samsungsem.com/servlet/FileDownload?filename=productcatalog/pdf/Chip_Resistor.pdf; ComponentLink1Description: http://www.samsungsem.com/servlet/FileDownload?filename=productcatalog/pdf/Chip_Resistor.pdf; Supplier 2: Digi-Key; Supplier Part Number 2: RMCF0805ZT0R00DKR-ND; Manufacturer 2: Stackpole Electronics Inc; Manufacturer Part Number 2: RMCF0805ZT0R00; RoHS 2: RoHS Compliant; ComponentLink2URL: http://www.seielect.com/Catalog/SEI-RMCF_RMCP.pdf; ComponentLink2Description: http://www.seielect.com/Catalog/SEI-RMCF_RMCP.pdf; Supplier 3: Digi-Key; Supplier Part Number 3: 311-0.0ARDKR-ND; Manufacturer 3: Yageo; Manufacturer Part Number 3: RC0805JR-070RL; RoHS 3: RoHS Compliant; ComponentLink3URL: http://media.digikey.com/pdf/Data%20Sheets/Yageo%20PDFs/RC0805%20Pb%20Free.pdf; ComponentLink3Description: http://media.digikey.com/pdf/Data%20Sheets/Yageo%20PDFs/RC0805%20Pb%20Free.pdf; Supplier 4: Digi-Key; Supplier Part Number 4: P0.0ADKR-ND; Manufacturer 4: Panasonic Electronic Components; Manufacturer Part Number 4: ERJ-6GEY0R00V; RoHS 4: RoHS Compliant; ComponentLink4URL: http://industrial.panasonic.com/www-cgi/jvcr13pz.cgi?E+PZ+3+AOA0001+ERJ6GEY0R00V+7+WW; ComponentLink4Description: http://industrial.panasonic.com/www-cgi/jvcr13pz.cgi?E+PZ+3+AOA0001+ERJ6GEY0R00V+7+WW; Supplier 5: Digi-Key; Supplier Part Number 5: RHM0.0CPDKR-ND; Manufacturer 5: Rohm Semiconductor; Manufacturer Part Number 5: MCR10ERTJ000; RoHS 5: RoHS Compliant; ComponentLink5URL: http://rohmfs.rohm.com/en/products/databook/datasheet/passive/resistor/chip_resistor/mcr_g.pdf; ComponentLink5Description: http://rohmfs.rohm.com/en/products/databook/datasheet/passive/resistor/chip_resistor/mcr_g.pdf
ST1-ST16 = Cherry MX Stabilizer: Stabilizer for Cherry MX compatible switches
SW1-SW96 = Cherry MX: Cherry MX keyboard switch

## Sheet keyboard_controller.SchDoc
size A4
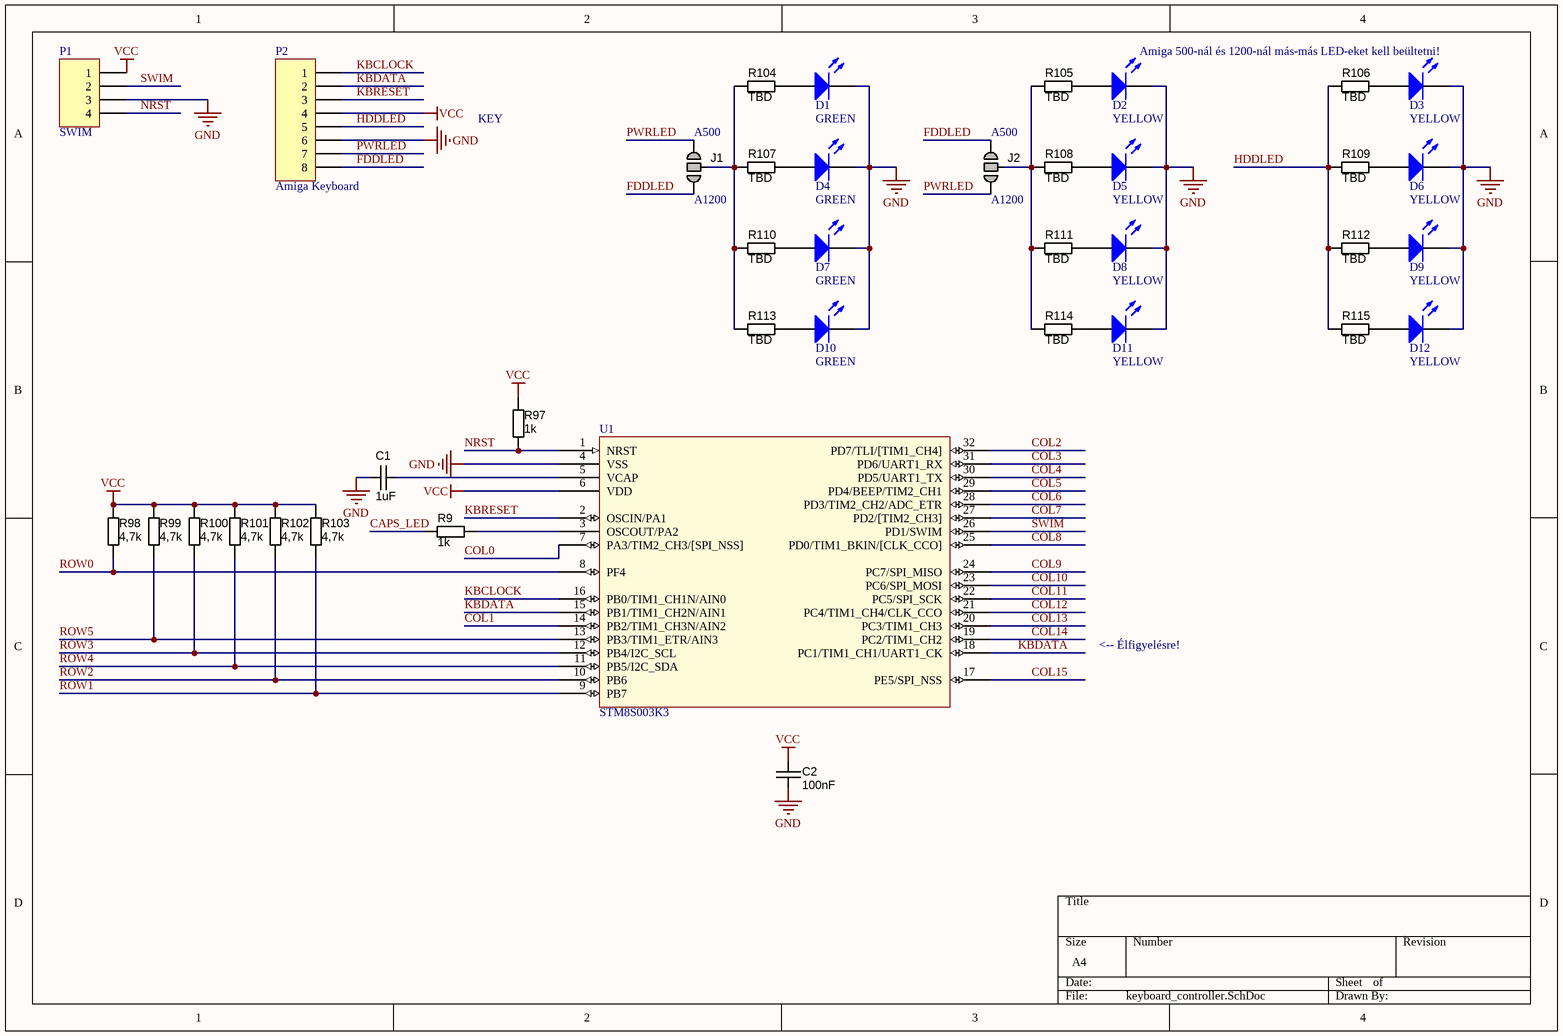
[diagram p2: keyboard_controller.SchDoc]

### Parts
C1  value 1uF  [CAPC2012X135N]  (hidden comment: 0805)
C2  value 100nF  [CAPC2012X135N]  (hidden comment: 0805)
D1  GREEN  [LEDSQ_5mm]
D2  YELLOW  [LEDSQ_5mm]
D3  YELLOW  [LEDSQ_5mm]
D4  GREEN  [LEDSQ_5mm]
D5  YELLOW  [LEDSQ_5mm]
D6  YELLOW  [LEDSQ_5mm]
D7  GREEN  [LEDSQ_5mm]
D8  YELLOW  [LEDSQ_5mm]
D9  YELLOW  [LEDSQ_5mm]
D10  GREEN  [LEDSQ_5mm]
D11  YELLOW  [LEDSQ_5mm]
D12  YELLOW  [LEDSQ_5mm]
J1  Jumper  [Jump_3Way]  (value not drawn)  (no BOM)
J2  Jumper  [Jump_3Way]  (value not drawn)  (no BOM)
P1  SWIM  [HDR1X4]
P2  Amiga Keyboard  [HDR1X8]
R9  value 1k  [RESC2012N_ZERO]  (hidden comment: 0805)
R97  value 1k  [RESC2012N_ZERO]  (hidden comment: 0805)
R98  value 4,7k  [RESC2012N_ZERO]  (hidden comment: 0805)
R99  value 4,7k  [RESC2012N_ZERO]  (hidden comment: 0805)
R100  value 4,7k  [RESC2012N_ZERO]  (hidden comment: 0805)
R101  value 4,7k  [RESC2012N_ZERO]  (hidden comment: 0805)
R102  value 4,7k  [RESC2012N_ZERO]  (hidden comment: 0805)
R103  value 4,7k  [RESC2012N_ZERO]  (hidden comment: 0805)
R104  value TBD  [RESC2012N_ZERO]  (hidden comment: 0805)
R105  value TBD  [RESC2012N_ZERO]  (hidden comment: 0805)
R106  value TBD  [RESC2012N_ZERO]  (hidden comment: 0805)
R107  value TBD  [RESC2012N_ZERO]  (hidden comment: 0805)
R108  value TBD  [RESC2012N_ZERO]  (hidden comment: 0805)
R109  value TBD  [RESC2012N_ZERO]  (hidden comment: 0805)
R110  value TBD  [RESC2012N_ZERO]  (hidden comment: 0805)
R111  value TBD  [RESC2012N_ZERO]  (hidden comment: 0805)
R112  value TBD  [RESC2012N_ZERO]  (hidden comment: 0805)
R113  value TBD  [RESC2012N_ZERO]  (hidden comment: 0805)
R114  value TBD  [RESC2012N_ZERO]  (hidden comment: 0805)
R115  value TBD  [RESC2012N_ZERO]  (hidden comment: 0805)
U1  STM8S003K3  [LQFP32_M]

### Nets
GND: C1.2 C2.2 D1.2(K) D2.2(K) D3.2(K) D4.2(K) D5.2(K) D6.2(K) D7.2(K) D8.2(K) D9.2(K) D10.2(K) D11.2(K) D12.2(K) P1.3 P2.6 U1.4(VSS)
VCC: C2.1 P1.1 P2.4 R97.2 R98.2 R99.2 R100.2 R101.2 R102.2 R103.2 U1.6(VDD)
CAPS_LED: R9.1
COL0: U1.7(PA3/TIM2_CH3/[SPI_NSS])
COL1: U1.14(PB2/TIM1_CH3N/AIN2)
COL2: U1.32(PD7/TLI/[TIM1_CH4])
COL3: U1.31(PD6/UART1_RX)
COL4: U1.30(PD5/UART1_TX)
COL5: U1.29(PD4/BEEP/TIM2_CH1)
COL6: U1.28(PD3/TIM2_CH2/ADC_ETR)
COL7: U1.27(PD2/[TIM2_CH3])
COL8: U1.25(PD0/TIM1_BKIN/[CLK_CCO])
COL9: U1.24(PC7/SPI_MISO)
COL10: U1.23(PC6/SPI_MOSI)
COL11: U1.22(PC5/SPI_SCK)
COL12: U1.21(PC4/TIM1_CH4/CLK_CCO)
COL13: U1.20(PC3/TIM1_CH3)
COL14: U1.19(PC2/TIM1_CH2)
COL15: U1.17(PE5/SPI_NSS)
FDDLED: J1.1 J2.3 P2.8
HDDLED: P2.5 R106.1 R109.1 R112.1 R115.1
KBCLOCK: P2.1 U1.16(PB0/TIM1_CH1N/AIN0)
KBDATA: P2.2 U1.15(PB1/TIM1_CH2N/AIN1) U1.18(PC1/TIM1_CH1/UART1_CK)
KBRESET: P2.3 U1.2(OSCIN/PA1)
NRST: P1.4 R97.1 U1.1(NRST)
PWRLED: J1.3 J2.1 P2.7
ROW0: R98.1 U1.8(PF4)
ROW1: R103.1 U1.9(PB7)
ROW2: R102.1 U1.10(PB6)
ROW3: R100.1 U1.12(PB4/I2C_SCL)
ROW4: R101.1 U1.11(PB5/I2C_SDA)
ROW5: R99.1 U1.13(PB3/TIM1_ETR/AIN3)
SWIM: P1.2 U1.26(PD1/SWIM)
NetC1_1: C1.1 U1.5(VCAP)
NetD1_1: D1.1(A) R104.2
NetD2_1: D2.1(A) R105.2
NetD3_1: D3.1(A) R106.2
NetD4_1: D4.1(A) R107.2
NetD5_1: D5.1(A) R108.2
NetD6_1: D6.1(A) R109.2
NetD7_1: D7.1(A) R110.2
NetD8_1: D8.1(A) R111.2
NetD9_1: D9.1(A) R112.2
NetD10_1: D10.1(A) R113.2
NetD11_1: D11.1(A) R114.2
NetD12_1: D12.1(A) R115.2
NetJ1_2: J1.2 R104.1 R107.1 R110.1 R113.1
NetJ2_2: J2.2 R105.1 R108.1 R111.1 R114.1
NetR9_2: R9.2 U1.3(OSCOUT/PA2)

### Notes on the sheet
- Amiga 500-nál és 1200-nál más-más LED-eket kell beültetni!
- KEY
- (near J1) A500
- (near J2) A500
- (near J1) A1200
- (near J2) A1200
- <-- Élfigyelésre!

### Library data of the parts
C1 C2 = CAPC_1u_0805_X7R_16V_10%: Capacitor SMD Cer X7R 0805; Tolerance: ±10%; Ratings: 16V; X7R; Material: ceramic; SCDType: spec; Package / Case: 0805 (2012 metric); Temperature Coefficient: X7R
D1-D12 = LED: Typical LED; Published: 8-Jun-2000; LatestRevisionDate: 08-Jul-2005; LatestRevisionNote: Mech Layer 1 removed.; PackageReference: LED-1; Publisher: Altium Limited; PackageDescription: LED; 2 Leads
J1 J2 = JUMP_3WAY: SMD jumper
P1 = Header 4: Header, 4-Pin; LatestRevisionDate: 17-Jul-2002; LatestRevisionNote: Re-released for DXP Platform.; Publisher: Altium Limited
P2 = Header 8: Header, 8-Pin; LatestRevisionDate: 17-Jul-2002; LatestRevisionNote: Re-released for DXP Platform.; Publisher: Altium Limited
R9 R97-R115 = RES_0R_0805: as R1 on sheet keyboard_matrix_full; Tolerance: N/A; Package / Case: 0805 (2012 metric); Supplier 1: Digi-Key; Supplier Part Number 1: 1276-5466-6-ND; RoHS 1: RoHS Compliant; ComponentLink1URL: http://www.samsungsem.com/servlet/FileDownload?filename=productcatalog/pdf/Chip_Resistor.pdf; ComponentLink1Description: http://www.samsungsem.com/servlet/FileDownload?filename=productcatalog/pdf/Chip_Resistor.pdf; Supplier 2: Digi-Key; Supplier Part Number 2: RMCF0805ZT0R00DKR-ND; Manufacturer 2: Stackpole Electronics Inc; Manufacturer Part Number 2: RMCF0805ZT0R00; RoHS 2: RoHS Compliant; ComponentLink2URL: http://www.seielect.com/Catalog/SEI-RMCF_RMCP.pdf; ComponentLink2Description: http://www.seielect.com/Catalog/SEI-RMCF_RMCP.pdf; Supplier 3: Digi-Key; Supplier Part Number 3: 311-0.0ARDKR-ND; Manufacturer 3: Yageo; Manufacturer Part Number 3: RC0805JR-070RL; RoHS 3: RoHS Compliant; ComponentLink3URL: http://media.digikey.com/pdf/Data%20Sheets/Yageo%20PDFs/RC0805%20Pb%20Free.pdf; ComponentLink3Description: http://media.digikey.com/pdf/Data%20Sheets/Yageo%20PDFs/RC0805%20Pb%20Free.pdf; Supplier 4: Digi-Key; Supplier Part Number 4: P0.0ADKR-ND; Manufacturer 4: Panasonic Electronic Components; Manufacturer Part Number 4: ERJ-6GEY0R00V; RoHS 4: RoHS Compliant; ComponentLink4URL: http://industrial.panasonic.com/www-cgi/jvcr13pz.cgi?E+PZ+3+AOA0001+ERJ6GEY0R00V+7+WW; ComponentLink4Description: http://industrial.panasonic.com/www-cgi/jvcr13pz.cgi?E+PZ+3+AOA0001+ERJ6GEY0R00V+7+WW; Supplier 5: Digi-Key; Supplier Part Number 5: RHM0.0CPDKR-ND; Manufacturer 5: Rohm Semiconductor; Manufacturer Part Number 5: MCR10ERTJ000; RoHS 5: RoHS Compliant; ComponentLink5URL: http://rohmfs.rohm.com/en/products/databook/datasheet/passive/resistor/chip_resistor/mcr_g.pdf; ComponentLink5Description: http://rohmfs.rohm.com/en/products/databook/datasheet/passive/resistor/chip_resistor/mcr_g.pdf
U1 = STM8S003K3: ST Microelectronics STM8S003K3 microcontroller

## Nets that join several sheets
GND: keyboard_matrix_full (96 pins), keyboard_controller (17 pins)
VCC: keyboard_matrix_full (95 pins), keyboard_controller (11 pins)
CAPS_LED: keyboard_matrix_full (SW9.3), keyboard_controller (R9.1)
COL0: keyboard_matrix_full (6 pins), keyboard_controller (U1.7)
COL1: keyboard_matrix_full (6 pins), keyboard_controller (U1.14)
COL2: keyboard_matrix_full (6 pins), keyboard_controller (U1.32)
COL3: keyboard_matrix_full (6 pins), keyboard_controller (U1.31)
COL4: keyboard_matrix_full (6 pins), keyboard_controller (U1.30)
COL5: keyboard_matrix_full (6 pins), keyboard_controller (U1.29)
COL6: keyboard_matrix_full (6 pins), keyboard_controller (U1.28)
COL7: keyboard_matrix_full (6 pins), keyboard_controller (U1.27)
COL8: keyboard_matrix_full (6 pins), keyboard_controller (U1.25)
COL9: keyboard_matrix_full (6 pins), keyboard_controller (U1.24)
COL10: keyboard_matrix_full (6 pins), keyboard_controller (U1.23)
COL11: keyboard_matrix_full (6 pins), keyboard_controller (U1.22)
COL12: keyboard_matrix_full (6 pins), keyboard_controller (U1.21)
COL13: keyboard_matrix_full (6 pins), keyboard_controller (U1.20)
COL14: keyboard_matrix_full (6 pins), keyboard_controller (U1.19)
COL15: keyboard_matrix_full (6 pins), keyboard_controller (U1.17)
ROW0: keyboard_matrix_full (16 pins), keyboard_controller (R98.1 U1.8)
ROW1: keyboard_matrix_full (16 pins), keyboard_controller (R103.1 U1.9)
ROW2: keyboard_matrix_full (16 pins), keyboard_controller (R102.1 U1.10)
ROW3: keyboard_matrix_full (16 pins), keyboard_controller (R100.1 U1.12)
ROW4: keyboard_matrix_full (16 pins), keyboard_controller (R101.1 U1.11)
ROW5: keyboard_matrix_full (16 pins), keyboard_controller (R99.1 U1.13)